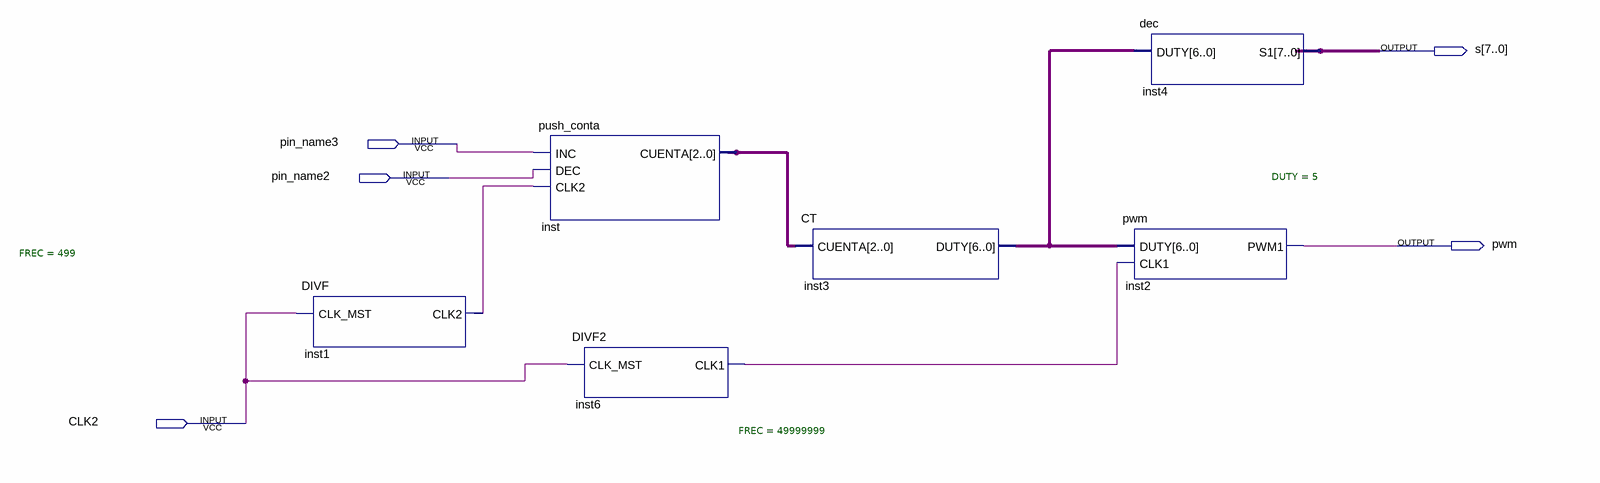
[diagram p0: schematic sheet]
// Quartus schematic Practica5.bdf as structural Verilog: 6 symbols, 5 pins
module Practica5 (
  input  pin_name3,
  input  pin_name2,
  input  CLK2,
  output [7:0] s,
  output pwm
);

  wire inst1_clk2, inst6_clk1;
  wire [2:0] inst_cuenta;
  wire [6:0] inst3_duty;

  DIVF #(.FREC(499)) inst1 (.CLK_MST(CLK2), .CLK2(inst1_clk2));
  push_conta inst (.INC(pin_name3), .DEC(pin_name2), .CLK2(inst1_clk2), .CUENTA(inst_cuenta));
  DIVF2 #(.FREC(49999999)) inst6 (.CLK_MST(CLK2), .CLK1(inst6_clk1));
  CT inst3 (.CUENTA(inst_cuenta), .DUTY(inst3_duty));
  dec inst4 (.DUTY(inst3_duty), .S1(s));
  pwm #(.DUTY(5)) inst2 (.DUTY(inst3_duty), .CLK1(inst6_clk1), .PWM1(pwm));
endmodule
